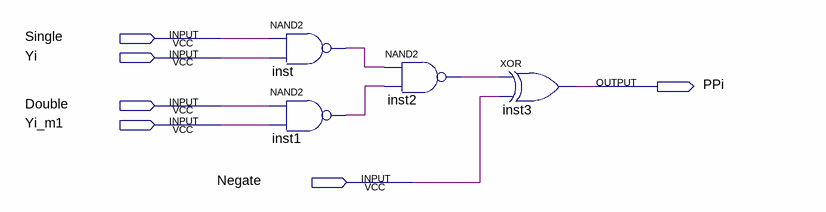
[diagram p0: schematic sheet]
// Quartus schematic PPgen.bdf as structural Verilog: 4 symbols, 6 pins
module PPgen (
  input  Single,
  input  Yi,
  input  Double,
  input  Yi_m1,
  input  Negate,
  output PPi
);

  wire inst1_out, inst2_out, inst_out;

  nand inst (inst_out, Single, Yi);
  nand inst1 (inst1_out, Double, Yi_m1);
  nand inst2 (inst2_out, inst_out, inst1_out);
  xor inst3 (PPi, inst2_out, Negate);
endmodule
